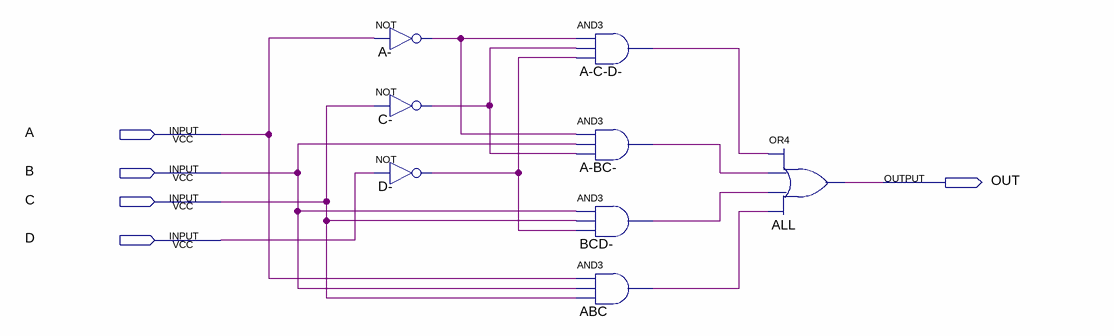
[diagram p0: schematic sheet]
// Quartus schematic f.bdf as structural Verilog: 8 symbols, 5 pins
module f (
  input  A,
  input  B,
  input  C,
  input  D,
  output OUT
);

  wire A__out, A_BC__out, A_C_D__out, ABC_out, BCD__out, C__out, D__out;

  not \A-  (A__out, A);
  not \C-  (C__out, C);
  not \D-  (D__out, D);
  and \A-C-D-  (A_C_D__out, A__out, C__out, D__out);
  and \A-BC-  (A_BC__out, A__out, B, C__out);
  and \BCD-  (BCD__out, B, C, D__out);
  and ABC (ABC_out, A, B, C);
  or ALL (OUT, A_C_D__out, A_BC__out, BCD__out, ABC_out);
endmodule
